# Altium schematic sheet SD_CARD.SchDoc
size A3; SheetNumber: 14; SheetTotal: 22
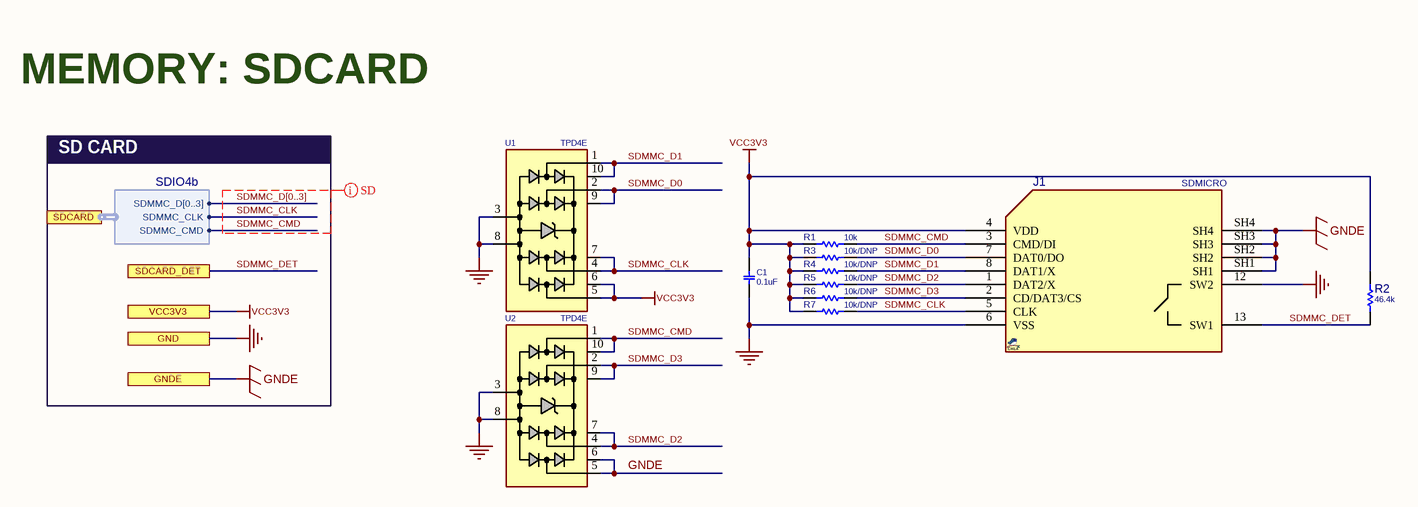
[diagram p0: SD_CARD.SchDoc]

## Parts
C1  0.1uF  [C0402]
J1  SDMICRO  [SDMICRO_MOLEX104031]
R1  10k  [R0402]
R2  46.4k  [R0402]
R3  10k/DNP  [R0402]
R4  10k/DNP  [R0402]
R5  10k/DNP  [R0402]
R6  10k/DNP  [R0402]
R7  10k/DNP  [R0402]
U1  TPD4E  [SON50_10_2510]
U2  TPD4E  [SON50_10_2510]

## Ports
GND, GNDE, SDCARD (harness SDIO4b), SDCARD_DET, VCC3V3

## Harnesses
SDIO4b: SDMMC_CMD, SDMMC_D[0..3], SDMMC_CLK

## Nets
GND: C1.2 J1.6(VSS) J1.12(SW2) U1.3 U1.8 U2.3 U2.8 ; port GND
GNDE: J1.SH1 J1.SH2 J1.SH3 J1.SH4 U2.5 U2.6 ; port GNDE
VCC3V3: C1.1 J1.4(VDD) R1.1 R2.2 R3.1 R4.1 R5.1 R6.1 R7.1 U1.5 U1.6 ; port VCC3V3
SDMMC_CLK: J1.5(CLK) R7.2 U1.4 U1.7 ; port SDCARD.SDMMC_CLK
SDMMC_CMD: J1.3(CMD/DI) R1.2 U2.1 U2.10 ; port SDCARD.SDMMC_CMD
SDMMC_D0: J1.7(DAT0/DO) R3.2 U1.2 U1.9
SDMMC_D1: J1.8(DAT1/X) R4.2 U1.1 U1.10
SDMMC_D2: J1.1(DAT2/X) R5.2 U2.4 U2.7
SDMMC_D3: J1.2(CD/DAT3/CS) R6.2 U2.2 U2.9
SDMMC_DET: J1.13(SW1) R2.1 ; port SDCARD_DET

## Buses and harness runs
bus SDMMC_D[0..3]

## Layout directives
net class SD: SDMMC_CLK, SDMMC_CMD, SDMMC_D[0..3]

## Notes on the sheet
- MEMORY: SDCARD
- SD CARD

## Library data of the parts
C1 = CAP_SMD_MLCC_100n50TDK: CAP, MLCC; PARAM: X5R, 10%; MANF_P#: GRM155R61E104; MANF: Murata; PARAM2: 25v; ASSEMBLY: ASSEMBLY; PRICE: 10,000:$0.006; VALUE: 0.1uF
J1 = SOCKET_SDMICRO_MOLEX104031: CONN MICRO SD R/A PUSHin-PULLout SMD; MANF: Molex; MANF_P#: 104031-0811; PRICE: 2$; VALUE: SDMICRO
R1-R7 = RES_SMD: RESISTOR, SMD; PARAM: 0.063W; DESC: DESCRIPTION; DIST#: MOUSER; PARAM2: 1%; MANF_P#: -; MANF: -; ASSEMBLY: ASSEMBLY; PRICE: 100= 0.3$
  R1: VALUE: 10k
  R2: VALUE: 46.4k
  R3-R7: VALUE: 10k/DNP
U1 U2 = TVS_X4_TPD4E05U06: TVS, ESD PROTECT, 4CH,; MANF_P#: TPD4E05U06DQA; MANF: Texas Instruments; PARAM2: 6.5Vbr, 0.4pF, –40°~125°C; PARAM: ±12-kV ContactD, ±15-kVAirD; PRICE: 0.6$; VALUE: TPD4E